# Altium schematic sheet MICROSD.SchDoc
size A
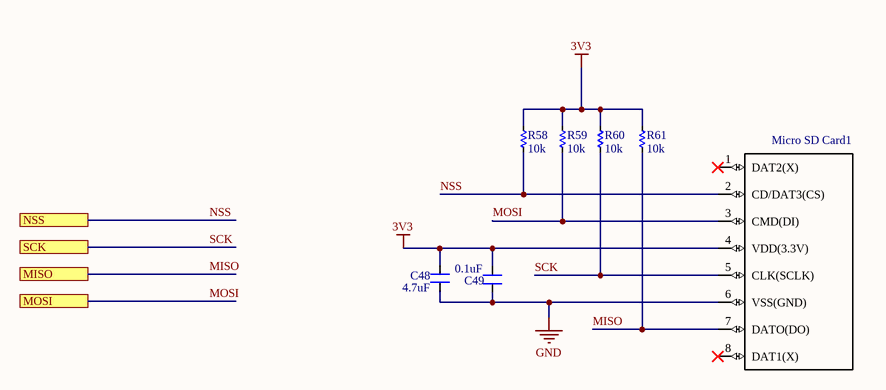
[diagram p0: MICROSD.SchDoc]

## Parts
C48  4.7uF  [res 0805 - duplicate]
C49  0.1uF  [res 0805 - duplicate]
Micro_SD_Card1  1140084168  [1140084168]  (value not drawn)
R58  10k  [res 0805 - duplicate]
R59  10k  [res 0805 - duplicate]
R60  10k  [res 0805 - duplicate]
R61  10k  [res 0805 - duplicate]

## Ports
MISO, MOSI, NSS, SCK

## Nets
3V3: C48.2 C49.2 Micro_SD_Card1.4(VDD(3.3V)) R58.1 R59.1 R60.1 R61.1
GND: C48.1 C49.1 Micro_SD_Card1.6(VSS(GND))
MISO: Micro_SD_Card1.7(DATO(DO)) R61.2 ; port MISO
MOSI: Micro_SD_Card1.3(CMD(DI)) R59.2 ; port MOSI
NSS: Micro_SD_Card1.2(CD/DAT3(CS)) R58.2 ; port NSS
SCK: Micro_SD_Card1.5(CLK(SCLK)) R60.2 ; port SCK

Not connected (* = marked no-connect by the designer): Micro_SD_Card1 1(DAT2(X))* 8(DAT1(X))*

## Library data of the parts
C48 = CN: Value: 0,1uF/300V; Designed by: VanDungEvn
C49 = CM: Cap SMD; Value: 103
Micro_SD_Card1 = 1140084168: Memory Card Connector, Microsd, 8 Position, Full Reel; MF: Amphenol Commercial; MP: 114-00841-68; Price: 1.08 USD; Package: None; Availability: Warning; SnapEDA_Link: https://www.snapeda.com/parts/114-00841-68/Amphenol%20Commercial%20Products/view-part/?ref=snap; Value: *
R58-R61 = Res-SMD: Resistor; Manufacturer: Generic Components; Class: Passive; Published: 08/06/2000; Publisher: Altium Hobart Technology Centre